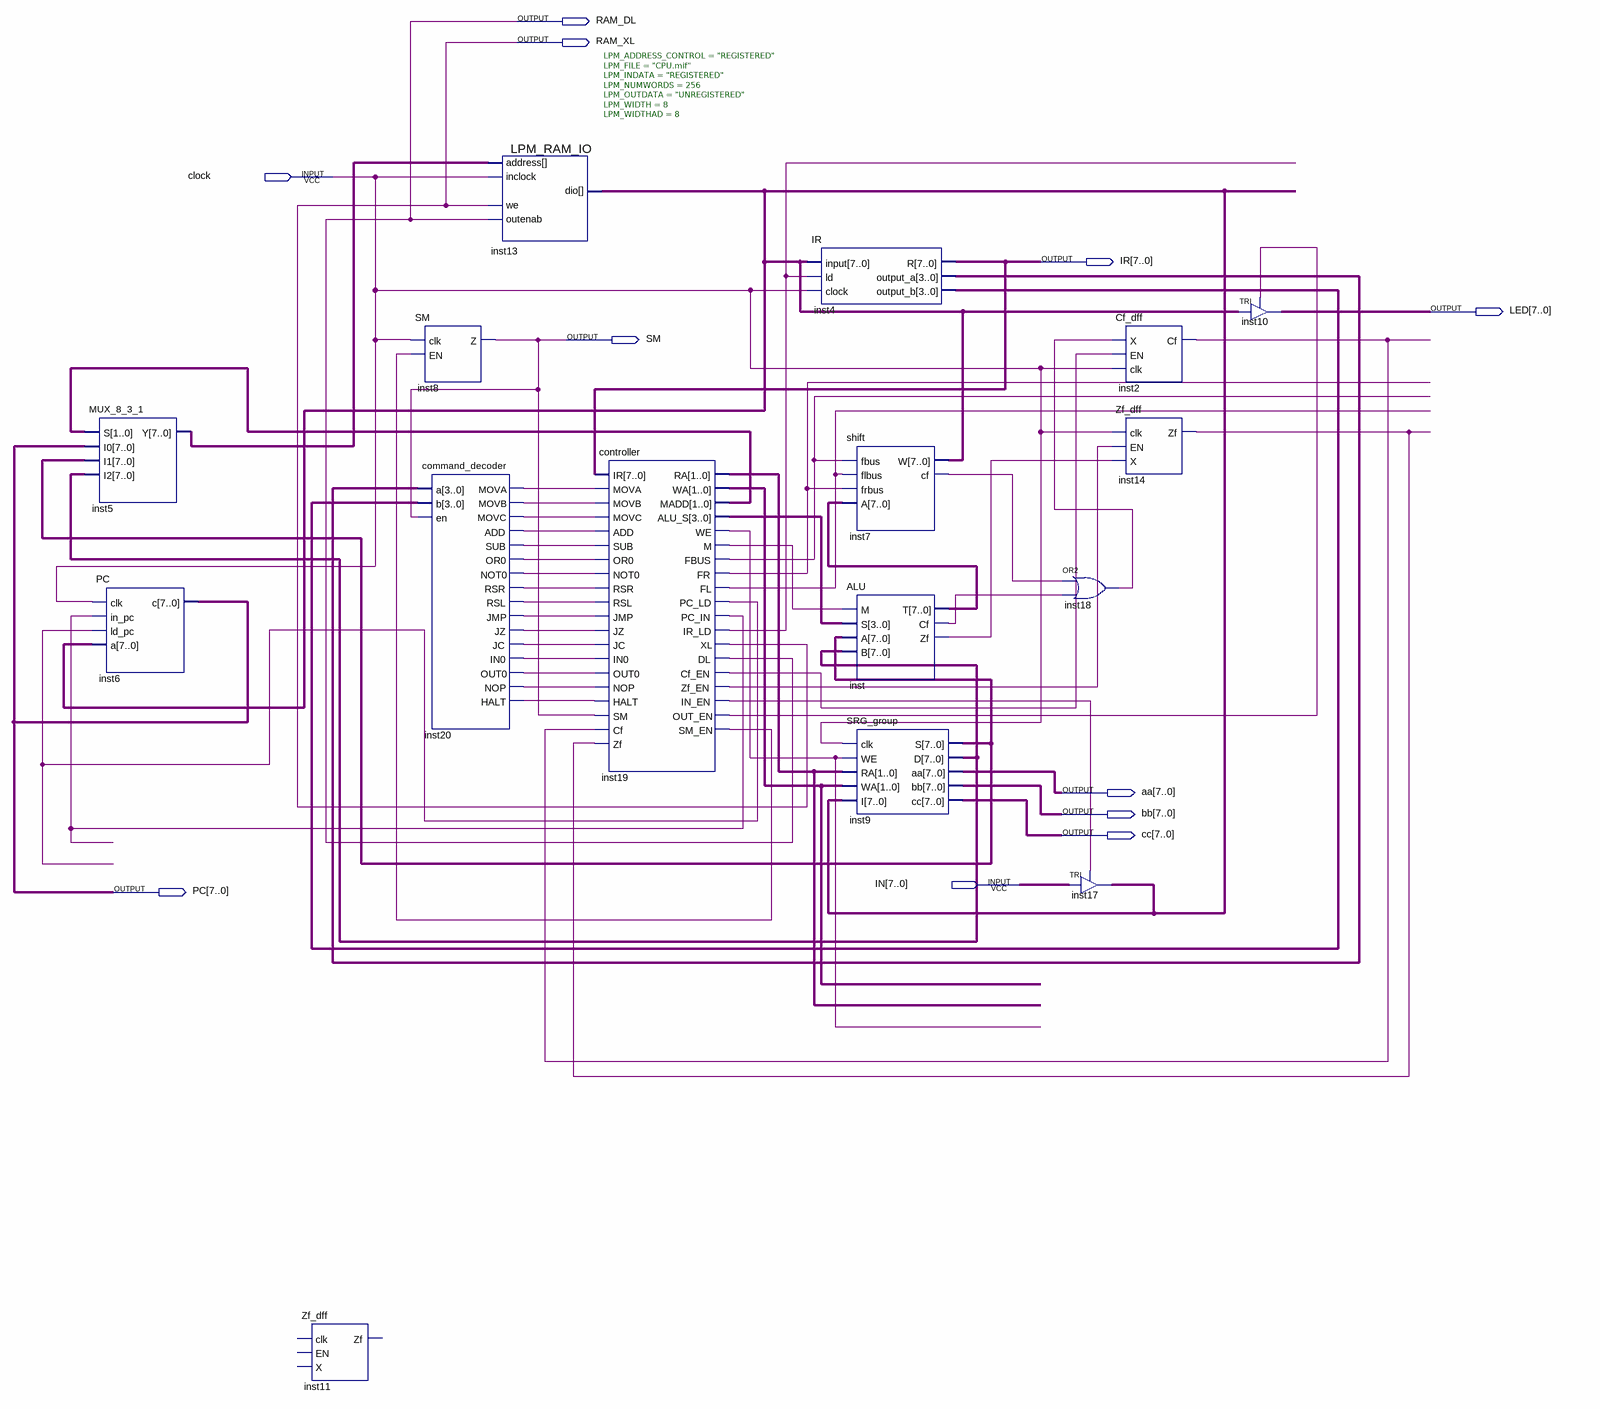
[diagram p0: schematic sheet]
// Quartus schematic CPU.bdf as structural Verilog: 16 symbols, 11 pins
module CPU (
  input  clock,
  input  [7:0] IN,
  output RAM_DL,
  output RAM_XL,
  output [7:0] IR,
  output [7:0] LED,
  output SM,
  output [7:0] aa,
  output [7:0] bb,
  output [7:0] cc,
  output [7:0] PC
);

  wire inst2_cf, inst7_cf, inst14_zf, inst18_out, inst19_cf_en, inst19_fbus, inst19_fl, inst19_fr,
       inst19_in_en, inst19_ir_ld, inst19_m, inst19_out_en, inst19_pc_in, inst19_pc_ld, inst19_sm_en,
       inst19_we, inst19_zf_en, inst20_add, inst20_halt, inst20_in0, inst20_jc, inst20_jmp, inst20_jz,
       inst20_mova, inst20_movb, inst20_movc, inst20_nop, inst20_not0, inst20_or0, inst20_out0, inst20_rsl,
       inst20_rsr, inst20_sub, inst_cf, inst_zf;
  wire [1:0] inst19_madd, inst19_ra, inst19_wa;
  wire [3:0] inst4_output_a, inst4_output_b, inst19_alu_s;
  wire [7:0] inst5_y, inst9_d, inst9_s, inst13_dio, inst_t;

  MUX_8_3_1 inst5 (.S(inst19_madd), .I0(PC), .I1(inst9_s), .I2(inst9_d), .Y(inst5_y));
  PC inst6 (.clk(clock), .in_pc(inst19_pc_in), .ld_pc(inst19_pc_ld), .a(inst13_dio), .c(PC));
  Zf_dff inst11 ();  // open: clk, EN, X, Zf
  SM inst8 (.clk(clock), .EN(inst19_sm_en), .Z(SM));
  command_decoder inst20 (
    .a(inst4_output_a), .b(inst4_output_b), .en(SM), .MOVA(inst20_mova), .MOVB(inst20_movb),
    .MOVC(inst20_movc), .ADD(inst20_add), .SUB(inst20_sub), .OR0(inst20_or0), .NOT0(inst20_not0),
    .RSR(inst20_rsr), .RSL(inst20_rsl), .JMP(inst20_jmp), .JZ(inst20_jz), .JC(inst20_jc), .IN0(inst20_in0),
    .OUT0(inst20_out0), .NOP(inst20_nop), .HALT(inst20_halt));
  LPM_RAM_IO #(.LPM_ADDRESS_CONTROL("REGISTERED"), .LPM_FILE("CPU.mif"), .LPM_INDATA("REGISTERED"), .LPM_NUMWORDS(256), .LPM_OUTDATA("UNREGISTERED"), .LPM_WIDTH(8), .LPM_WIDTHAD(8)) inst13 (
    .address(inst5_y), .inclock(clock), .we(RAM_XL), .outenab(RAM_DL), .dio(inst13_dio));
  controller inst19 (
    .IR(IR), .MOVA(inst20_mova), .MOVB(inst20_movb), .MOVC(inst20_movc), .ADD(inst20_add), .SUB(inst20_sub),
    .OR0(inst20_or0), .NOT0(inst20_not0), .RSR(inst20_rsr), .RSL(inst20_rsl), .JMP(inst20_jmp),
    .JZ(inst20_jz), .JC(inst20_jc), .IN0(inst20_in0), .OUT0(inst20_out0), .NOP(inst20_nop),
    .HALT(inst20_halt), .SM(SM), .Cf(inst2_cf), .Zf(inst14_zf), .RA(inst19_ra), .WA(inst19_wa),
    .MADD(inst19_madd), .ALU_S(inst19_alu_s), .WE(inst19_we), .M(inst19_m), .FBUS(inst19_fbus),
    .FR(inst19_fr), .FL(inst19_fl), .PC_LD(inst19_pc_ld), .PC_IN(inst19_pc_in), .IR_LD(inst19_ir_ld),
    .XL(RAM_XL), .DL(RAM_DL), .Cf_EN(inst19_cf_en), .Zf_EN(inst19_zf_en), .IN_EN(inst19_in_en),
    .OUT_EN(inst19_out_en), .SM_EN(inst19_sm_en));
  IR inst4 (
    .\input (inst13_dio), .ld(inst19_ir_ld), .clock(clock), .R(IR), .output_a(inst4_output_a),
    .output_b(inst4_output_b));
  shift inst7 (.fbus(inst19_fbus), .flbus(inst19_fl), .frbus(inst19_fr), .A(inst_t), .W(inst13_dio), .cf(inst7_cf));
  ALU inst (.M(inst19_m), .S(inst19_alu_s), .A(inst9_s), .B(inst9_d), .T(inst_t), .Cf(inst_cf), .Zf(inst_zf));
  SRG_group inst9 (
    .clk(clock), .WE(inst19_we), .RA(inst19_ra), .WA(inst19_wa), .I(inst13_dio), .S(inst9_s), .D(inst9_d),
    .aa(aa), .bb(bb), .cc(cc));
  Cf_dff inst2 (.X(inst18_out), .EN(inst19_cf_en), .clk(clock), .Cf(inst2_cf));
  Zf_dff inst14 (.clk(clock), .EN(inst19_zf_en), .X(inst_zf), .Zf(inst14_zf));
  or inst18 (inst18_out, inst7_cf, inst_cf);
  TRI inst17[7:0] (.IN(IN), .OE(inst19_in_en), .OUT(inst13_dio));
  TRI inst10[7:0] (.IN(inst13_dio), .OE(inst19_out_en), .OUT(LED));
endmodule
